# EasyEDA schematic ESP32 JTAG Schematic.json
TITLE: ESP32 DevKit4 JTAG Break Out Board; REV: 1.0; Date: 2023-02-11; Sheet: 1/1; Drawn By: ralphbacon; Company: Arduino YouTube
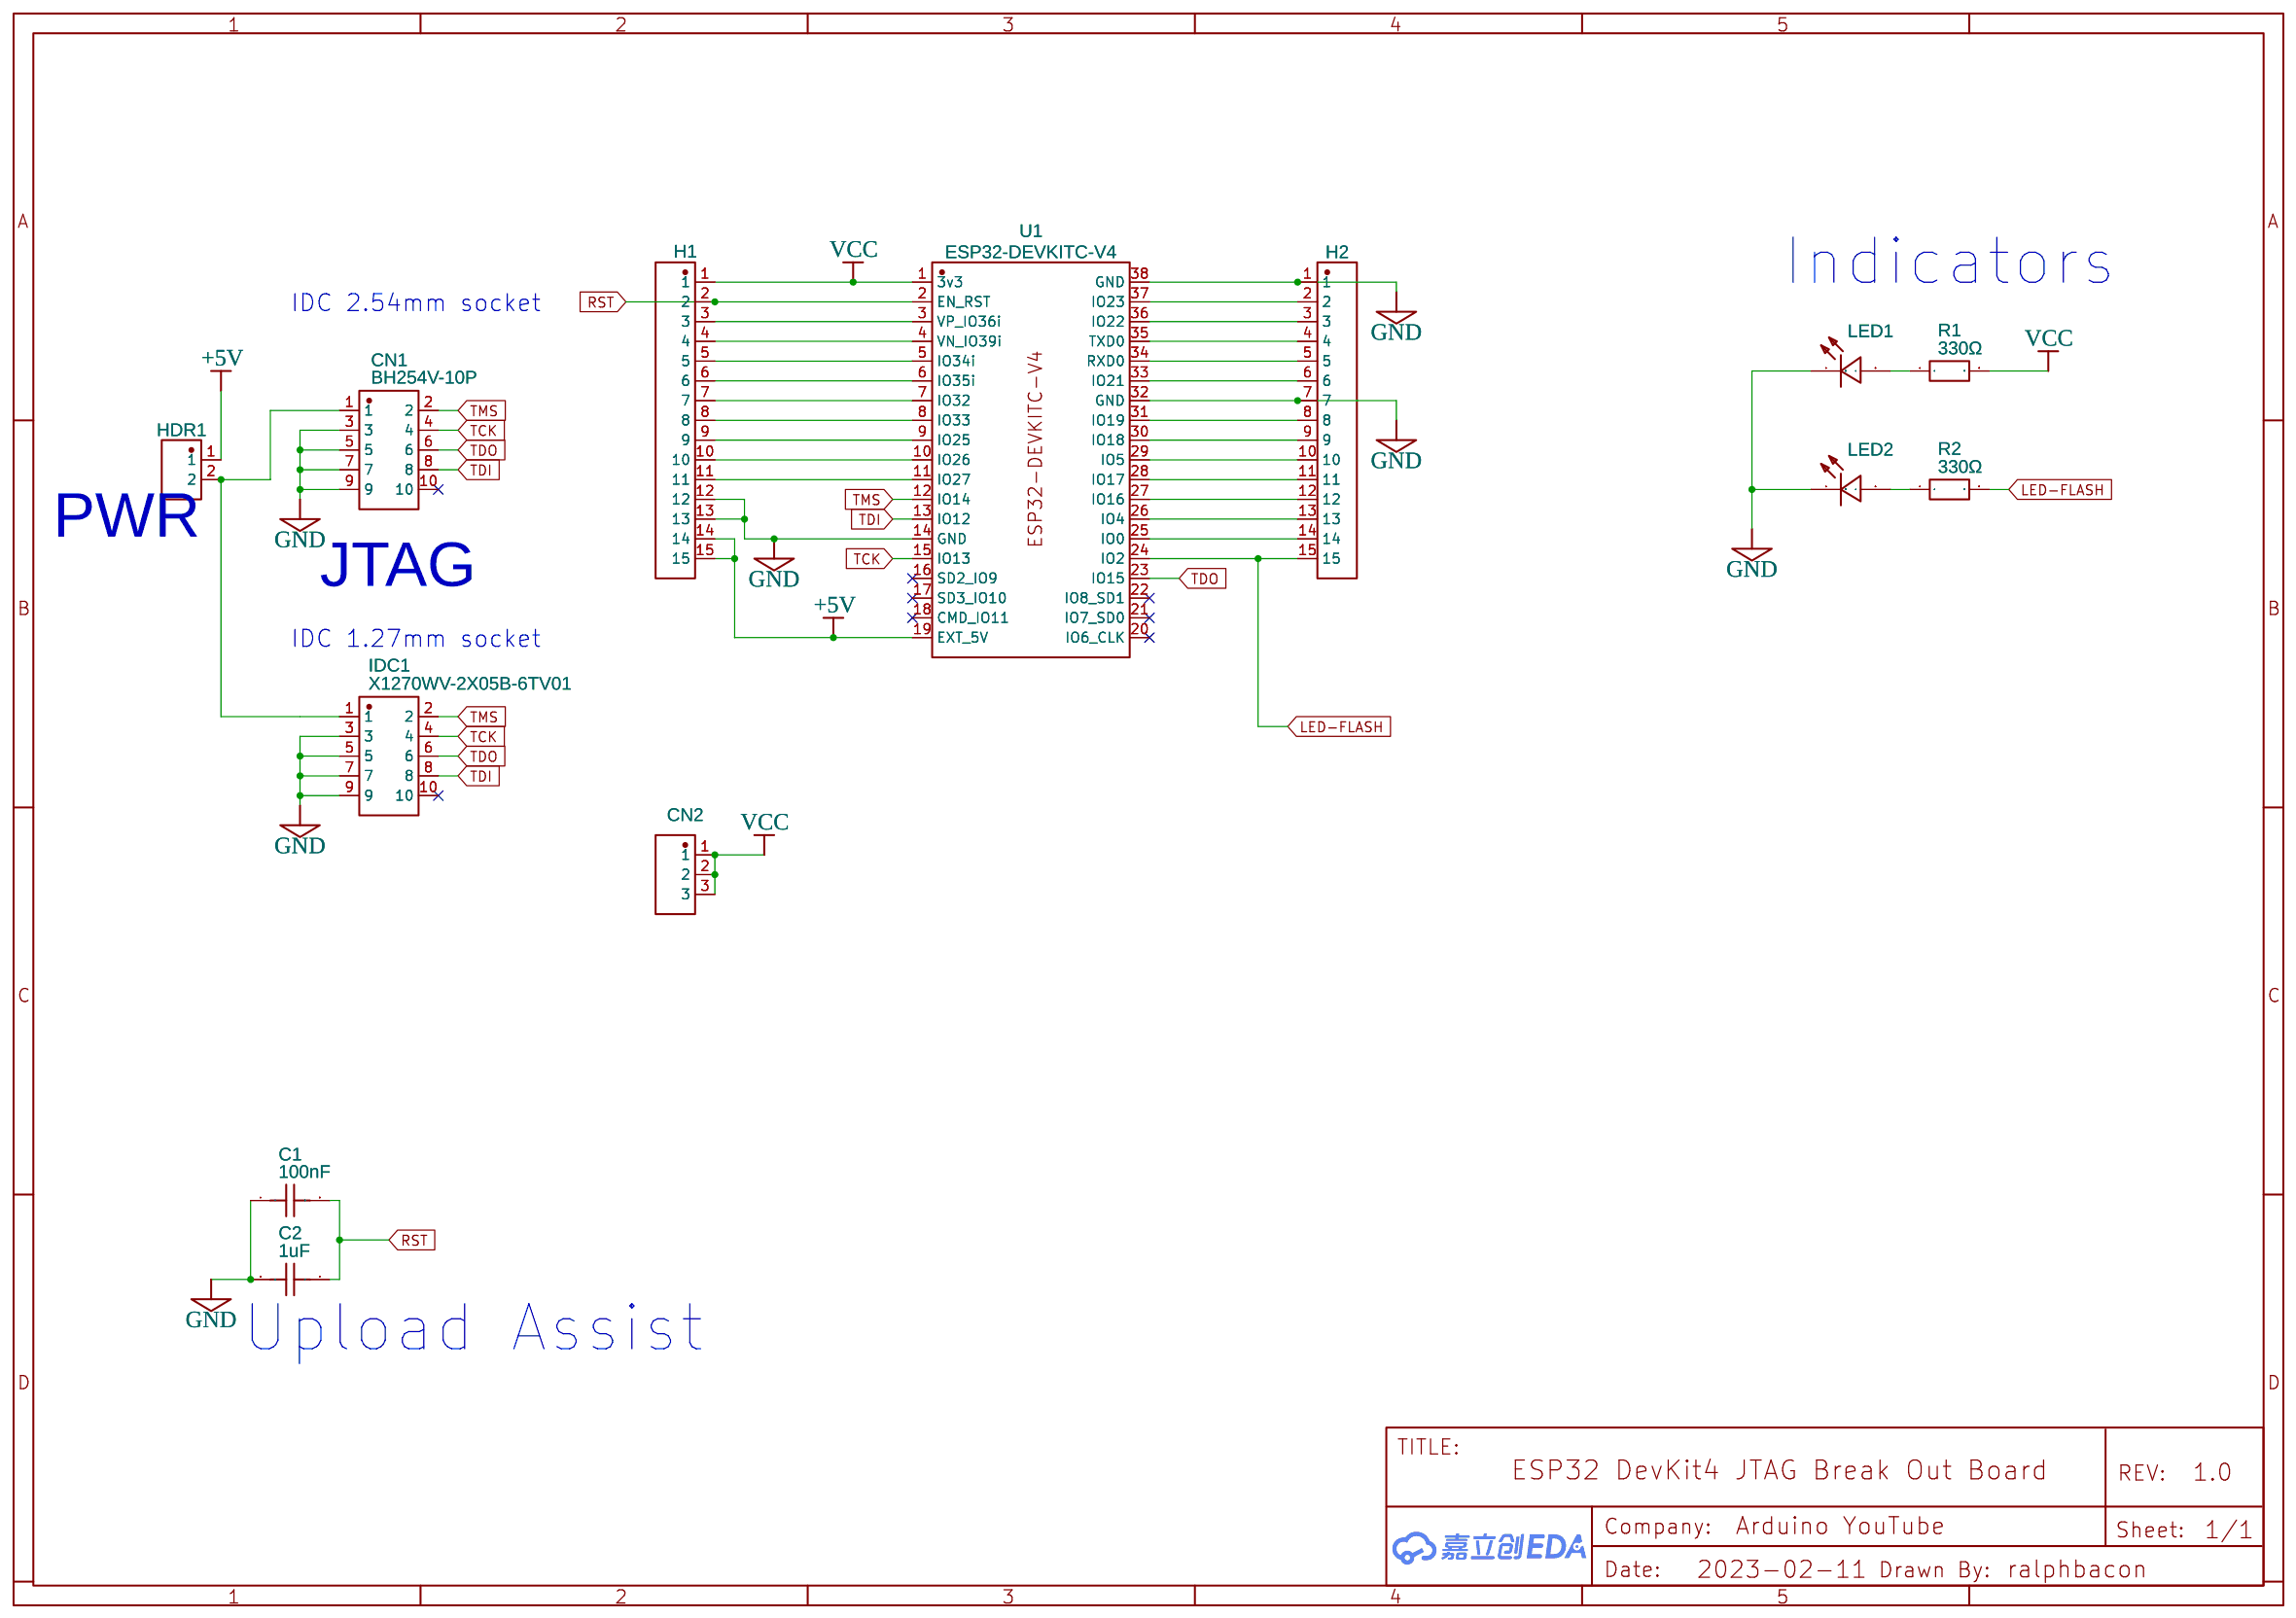
[diagram p0: schematic sheet]

## Parts
C1  100nF  [C0805]
C2  1uF  [C0805]
CN1  BH254V-10P  [IDC-TH_10P-P2.54-V-R2-C5-S2.54]
CN2  G800W305018EU  [HDR-TH_3P-P2.54-V-M-1]
H1  PZ254-1-15-Z-8.5  [HDR-TH_15P-P2.54-V-M]
H2  PZ254-1-15-Z-8.5  [HDR-TH_15P-P2.54-V-M]
HDR1  SIP2-2.54MM2X1双排针  [HDR-TH_2P-P2.54-V-M-R2-C1-S2.54]
IDC1  X1270WV-2X05B-6TV01  [IDC-TH_10P-P1.27-X1270WV-2X05A-6TV01]
LED1  SMDREDLED红色超高亮0805  [LED0805-RD_RED]
LED2  SMDREDLED红色超高亮0805  [LED0805-RD_RED]
R1  330Ω  [R0603]
R2  330Ω  [R0603]
U1  ESP32-DEVKITC-V4  [ESP32-DEVKITC-V4]

## Library data of the parts
C1 = 0805ZC104KAT2A: Supplier: LCSC; Supplier Part: C597440; Manufacturer: Kyocera AVX; Contributor: LCSC; JLCPCB Part Class: Extended Part
C2 = TCC0805X7R105K500FTA: Supplier: LCSC; Supplier Part: C282737; Manufacturer: CCTC(三环); Contributor: LCSC; JLCPCB Part Class: Extended Part
CN1 = BH254V-10P: Supplier: LCSC; Supplier Part: C492442; Manufacturer: XFCN(兴飞); Contributor: LCSC; JLCPCB Part Class: Extended Part
CN2 = G800W305018EU: Supplier: LCSC; Supplier Part: C9900019508; Manufacturer: null; JLCPCB Part Class: Extended Part; Contributor: lcsc
H1 H2 = PZ254-1-15-Z-8.5: Supplier: LCSC; Supplier Part: C2894938; Manufacturer: HCTL(华灿天禄); Contributor: LCSC; JLCPCB Part Class: Extended Part
HDR1 = SIP2-2.54MM2X1双排针: Supplier: LCSC; Supplier Part: C9900003704; Manufacturer: null; Manufacturer Part: SIP2-2.54mm2X1双排针; Contributor: LCSC; JLCPCB Part Class: Extended Part
IDC1 = X1270WV-2X05B-6TV01: Supplier: LCSC; Supplier Part: C2962225; Manufacturer: XKB Connectivity(中国星坤); Manufacturer Part: X1270WV-2x05B-6TV01; link: https://atta.szlcsc.com/upload/public/pdf/source/20220119/EEE69E132D70AAE9A26E93059D34F2BD.pdf; JLCPCB Part Class: Extended Part; Contributor: lcsc
LED1 LED2 = SMDREDLED红色超高亮0805: Supplier: LCSC; Supplier Part: C9900019100; Manufacturer: null; Manufacturer Part: SMDRedLED红色超高亮0805; JLCPCB Part Class: Extended Part; Contributor: lcsc
R1 R2 = RT0603DRD07330RL: Supplier: LCSC; Supplier Part: C723588; Manufacturer: YAGEO(国巨); Contributor: LCSC; JLCPCB Part Class: Extended Part
U1 = ESP32-DevKitC v4: Supplier: Espressif; link: https://docs.espressif.com/projects/esp-idf/en/latest/esp32/hw-reference/esp32/get-started-devkitc.html; Contributor: AlexAndersson

## Nets
+5V: H1.14 H1.15 HDR1.1 U1.19(EXT_5V)
GND: C1.1 C2.2 CN1.3 CN1.5 CN1.7 CN1.9 H1.12 H1.13 H2.1 H2.7 IDC1.3 IDC1.5 IDC1.7 IDC1.9 LED1.1(C) LED2.1(C) U1.14(GND) U1.32(GND) U1.38(GND)
VCC: CN2.1 CN2.2 CN2.3 H1.1 R1.2 U1.1(3v3)
LED-FLASH: H2.15 R2.2 U1.24(IO2)
RST: C1.2 C2.1 H1.2 U1.2(EN RST)
TCK: CN1.4 IDC1.4 U1.15(IO13)
TDI: CN1.8 IDC1.8 U1.13(IO12)
TDO: CN1.6 IDC1.6 U1.23(IO15)
TMS: CN1.2 IDC1.2 U1.12(IO14)
Net-(CN1-1): CN1.1 HDR1.2 IDC1.1
Net-(H1-3): H1.3 U1.3(VP IO36i)
Net-(H1-4): H1.4 U1.4(VN IO39i)
Net-(H1-5): H1.5 U1.5(IO34i)
Net-(H1-6): H1.6 U1.6(IO35i)
Net-(H1-7): H1.7 U1.7(IO32)
Net-(H1-8): H1.8 U1.8(IO33)
Net-(H1-9): H1.9 U1.9(IO25)
Net-(H1-10): H1.10 U1.10(IO26)
Net-(H1-11): H1.11 U1.11(IO27)
Net-(H2-2): H2.2 U1.37(IO23)
Net-(H2-3): H2.3 U1.36(IO22)
Net-(H2-4): H2.4 U1.35(TXD0)
Net-(H2-5): H2.5 U1.34(RXD0)
Net-(H2-6): H2.6 U1.33(IO21)
Net-(H2-8): H2.8 U1.31(IO19)
Net-(H2-9): H2.9 U1.30(IO18)
Net-(H2-10): H2.10 U1.29(IO5)
Net-(H2-11): H2.11 U1.28(IO17)
Net-(H2-12): H2.12 U1.27(IO16)
Net-(H2-13): H2.13 U1.26(IO4)
Net-(H2-14): H2.14 U1.25(IO0)
Net-(LED1-2): LED1.2(A) R1.1
Net-(LED2-2): LED2.2(A) R2.1

Not connected (* = marked no-connect by the designer): CN1 10*; IDC1 10*; U1 16(SD2 IO9)* 17(SD3 IO10)* 18(CMD IO11)* 20(IO6 CLK)* 21(IO7 SD0)* 22(IO8 SD1)*

## Notes on the sheet
- Indicators
- IDC 2.54mm socket
- PWR
- JTAG
- IDC 1.27mm socket
- Upload Assist
